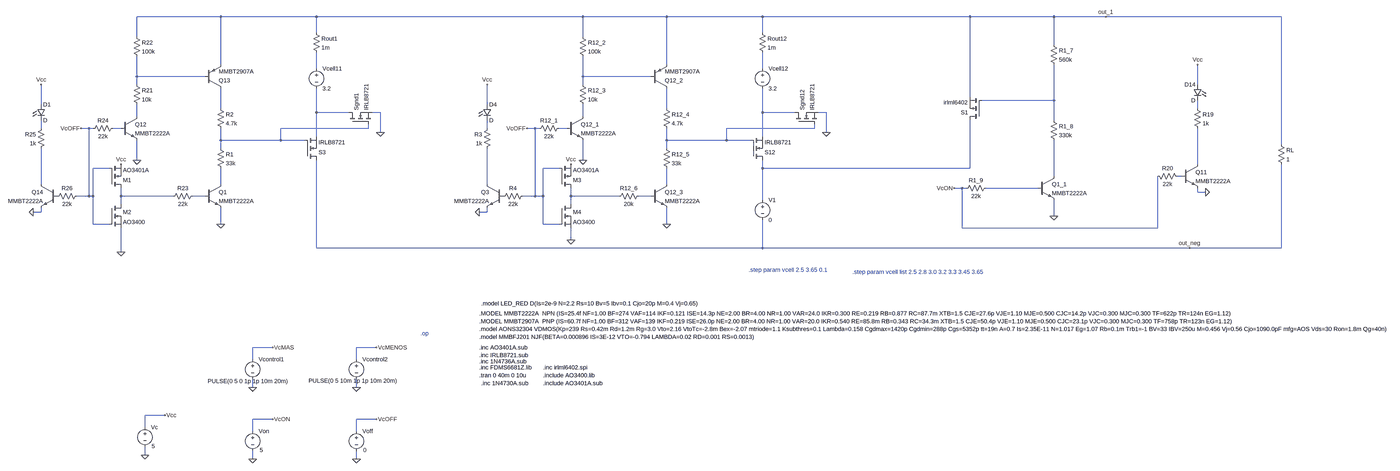
[diagram p0: schematic version_2x1_moset_tierra.asc, whole sheet]
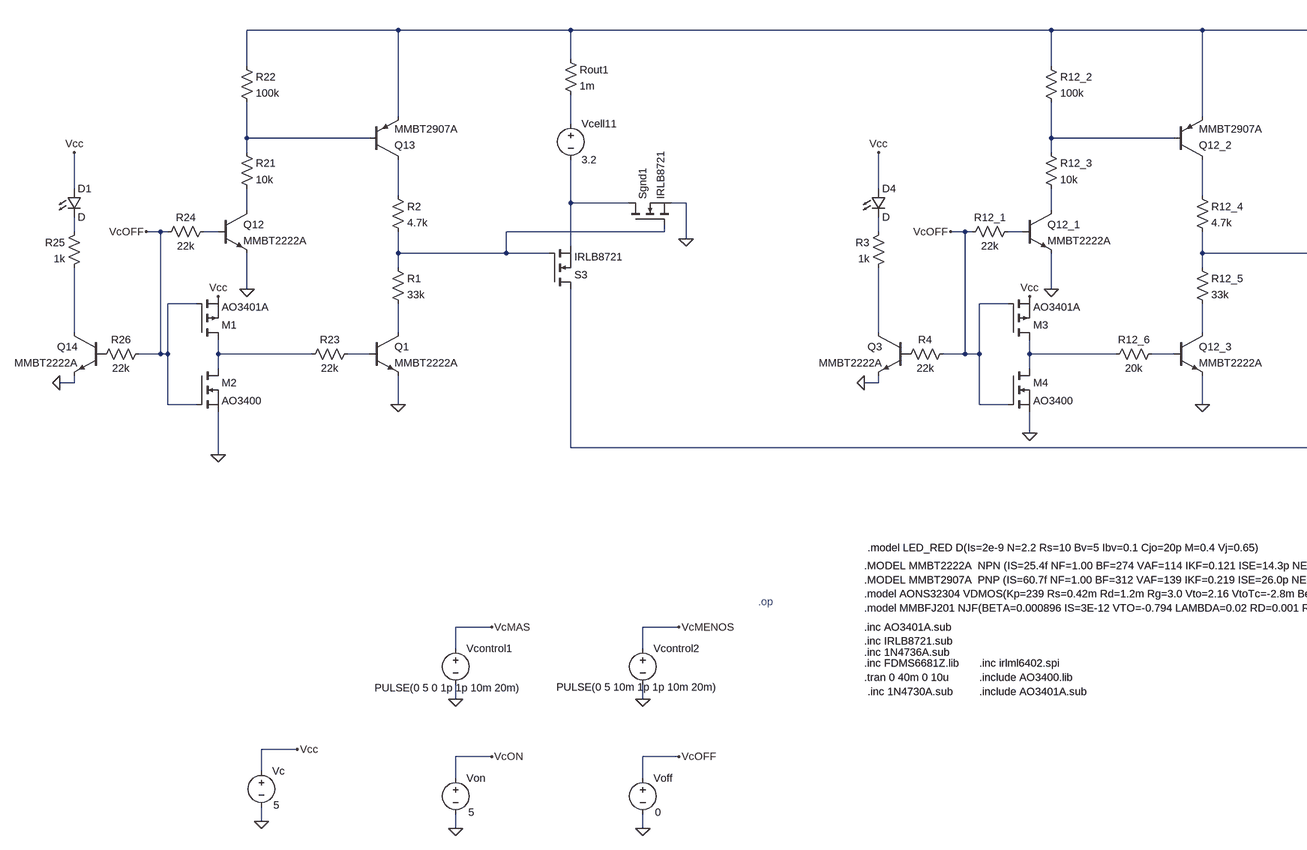
[diagram p1: schematic version_2x1_moset_tierra.asc, part, row 1 of 1, column 1 of 2]
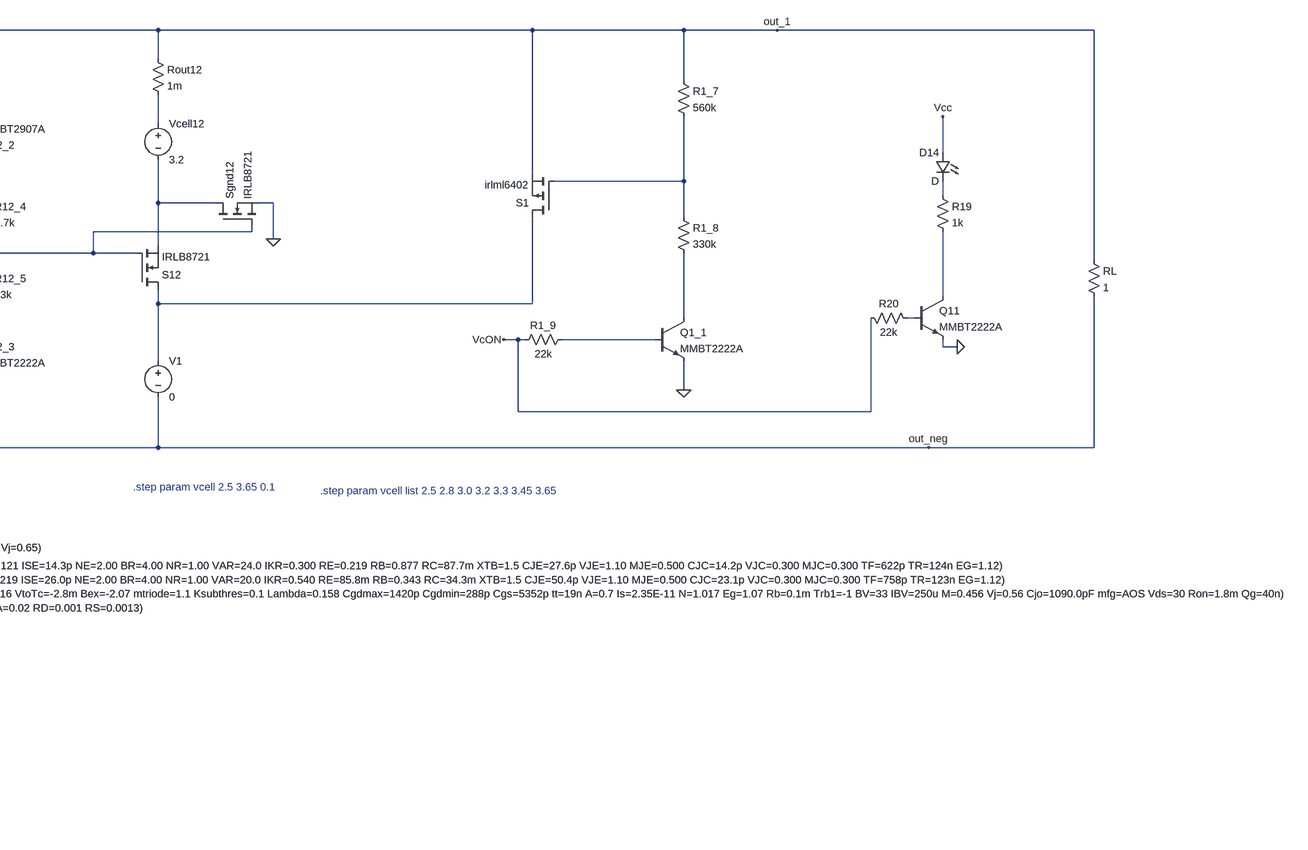
[diagram p2: schematic version_2x1_moset_tierra.asc, part, row 1 of 1, column 2 of 2]
version_2x1_moset_tierra.asc, the LTspice schematic file:
Version 4.1
SHEET 1 7672 2128
WIRE -1280 -368 -1616 -368
WIRE -896 -368 -1280 -368
WIRE 192 -368 -896 -368
WIRE 528 -368 192 -368
WIRE 912 -368 528 -368
WIRE 1744 -368 912 -368
WIRE 2080 -368 1744 -368
WIRE 2288 -368 2080 -368
WIRE 2992 -368 2288 -368
WIRE -896 -304 -896 -368
WIRE 912 -304 912 -368
WIRE -1616 -288 -1616 -368
WIRE 192 -288 192 -368
WIRE 2080 -256 2080 -368
WIRE -1280 -176 -1280 -368
WIRE 528 -176 528 -368
WIRE -896 -160 -896 -224
WIRE 912 -160 912 -224
WIRE -1616 -128 -1616 -208
WIRE -1344 -128 -1616 -128
WIRE 192 -128 192 -208
WIRE 464 -128 192 -128
WIRE -1616 -96 -1616 -128
WIRE 192 -96 192 -128
WIRE 2656 -96 2656 -176
WIRE 1744 -48 1744 -368
WIRE 2080 -32 2080 -176
WIRE 2080 -32 1792 -32
WIRE -2000 -16 -2000 -96
WIRE -192 -16 -192 -96
WIRE -1280 0 -1280 -80
WIRE 528 0 528 -80
WIRE 2656 0 2656 -32
WIRE -896 16 -896 -80
WIRE -768 16 -896 16
WIRE -640 16 -672 16
WIRE 912 16 912 -80
WIRE 1040 16 912 16
WIRE 1168 16 1136 16
WIRE -1616 32 -1616 -16
WIRE 192 32 192 -16
WIRE 2080 48 2080 -32
WIRE -2000 80 -2000 48
WIRE -1808 80 -1840 80
WIRE -1792 80 -1808 80
WIRE -1680 80 -1712 80
WIRE -688 80 -688 64
WIRE -688 80 -1040 80
WIRE -192 80 -192 48
WIRE 0 80 -32 80
WIRE 16 80 0 80
WIRE 128 80 96 80
WIRE 1120 80 1120 64
WIRE 1120 80 768 80
WIRE -640 96 -640 16
WIRE 1168 96 1168 16
WIRE -896 112 -896 16
WIRE 912 112 912 16
WIRE -1280 128 -1280 80
WIRE -1040 128 -1040 80
WIRE -1040 128 -1280 128
WIRE -944 128 -1040 128
WIRE 528 128 528 80
WIRE 768 128 768 80
WIRE 768 128 528 128
WIRE 864 128 768 128
WIRE 2992 144 2992 -368
WIRE -1280 160 -1280 128
WIRE 528 160 528 128
WIRE -1616 208 -1616 128
WIRE 192 208 192 128
WIRE 2656 224 2656 80
WIRE -1728 240 -1792 240
WIRE 96 240 32 240
WIRE 912 240 912 208
WIRE 1744 240 1744 48
WIRE 1744 240 912 240
WIRE 2080 272 2080 128
WIRE 2592 272 2576 272
WIRE -2000 304 -2000 160
WIRE -1280 304 -1280 240
WIRE -192 304 -192 160
WIRE 528 304 528 240
WIRE 1712 320 1680 320
WIRE 1728 320 1712 320
WIRE 2016 320 1808 320
WIRE 2656 336 2656 320
WIRE 2688 336 2656 336
WIRE -1808 352 -1808 80
WIRE -1808 352 -1856 352
WIRE -1792 352 -1792 240
WIRE -1792 352 -1808 352
WIRE -1680 352 -1680 320
WIRE -1472 352 -1680 352
WIRE -1344 352 -1392 352
WIRE 0 352 0 80
WIRE 0 352 -48 352
WIRE 32 352 32 240
WIRE 32 352 0 352
WIRE 144 352 144 320
WIRE 336 352 144 352
WIRE 464 352 416 352
WIRE 912 368 912 240
WIRE -1680 384 -1680 352
WIRE 144 384 144 352
WIRE -2000 416 -2000 400
WIRE -2000 416 -2032 416
WIRE -192 416 -192 400
WIRE -192 416 -224 416
WIRE 2080 432 2080 368
WIRE -1792 464 -1792 352
WIRE -1728 464 -1792 464
WIRE -1280 464 -1280 400
WIRE 32 464 32 352
WIRE 96 464 32 464
WIRE 528 464 528 400
WIRE 1712 480 1712 320
WIRE 2496 480 2496 272
WIRE 2496 480 1712 480
WIRE 144 528 144 480
WIRE -896 560 -896 208
WIRE 912 560 912 448
WIRE 912 560 -896 560
WIRE 2624 560 912 560
WIRE 2992 560 2992 224
WIRE 2992 560 2624 560
WIRE -1680 576 -1680 480
WIRE -1072 1024 -1152 1024
WIRE -656 1024 -736 1024
WIRE -1152 1072 -1152 1024
WIRE -736 1072 -736 1024
WIRE -1152 1184 -1152 1152
WIRE -736 1184 -736 1152
WIRE -1504 1296 -1584 1296
WIRE -1072 1312 -1152 1312
WIRE -656 1312 -736 1312
WIRE -1584 1344 -1584 1296
WIRE -1152 1360 -1152 1312
WIRE -736 1360 -736 1312
WIRE -1584 1456 -1584 1424
WIRE -1152 1472 -1152 1440
WIRE -736 1472 -736 1440
FLAG 192 208 0
FLAG 528 464 0
FLAG -1152 1184 0
FLAG -736 1184 0
FLAG -1072 1024 VcMAS
FLAG -656 1024 VcMENOS
FLAG -736 1472 0
FLAG -656 1312 VcOFF
FLAG -1152 1472 0
FLAG -1072 1312 VcON
FLAG -32 80 VcOFF
FLAG 2624 560 out_neg
FLAG 2288 -368 out_1
FLAG 2080 432 0
FLAG 1680 320 VcON
FLAG 1168 96 0
FLAG -224 416 0
FLAG 2688 336 0
FLAG 2656 -176 Vcc
FLAG -192 -96 Vcc
FLAG -1616 208 0
FLAG -1280 464 0
FLAG -1840 80 VcOFF
FLAG -640 96 0
FLAG -2032 416 0
FLAG -2000 -96 Vcc
FLAG -1680 576 0
FLAG -1680 224 Vcc
FLAG -1584 1456 0
FLAG -1504 1296 Vcc
FLAG 144 528 0
FLAG 144 224 Vcc
SYMBOL npn 464 304 R0
SYMATTR InstName Q12_3
SYMATTR Value MMBT2222A
SYMBOL res 512 144 R0
SYMATTR InstName R12_5
SYMATTR Value 33k
SYMBOL res 512 -16 R0
SYMATTR InstName R12_4
SYMATTR Value 4.7k
SYMBOL npn 128 32 R0
SYMATTR InstName Q12_1
SYMATTR Value MMBT2222A
SYMBOL res 176 -112 R0
SYMATTR InstName R12_3
SYMATTR Value 10k
SYMBOL res 176 -304 R0
SYMATTR InstName R12_2
SYMATTR Value 100k
SYMBOL res 432 336 R90
WINDOW 0 0 56 VBottom 2
WINDOW 3 32 56 VTop 2
SYMATTR InstName R12_6
SYMATTR Value 20k
SYMBOL voltage 912 -176 R0
WINDOW 123 0 0 Left 0
WINDOW 39 0 0 Left 0
SYMATTR InstName Vcell12
SYMATTR Value 3.2
SYMBOL pnp 464 -80 M180
SYMATTR InstName Q12_2
SYMATTR Value MMBT2907A
SYMBOL nmos 864 208 M180
SYMATTR InstName S12
SYMATTR Value IRLB8721
SYMATTR Prefix X
SYMBOL voltage -1152 1056 R0
WINDOW 3 -180 103 Left 2
WINDOW 123 0 0 Left 0
WINDOW 39 0 0 Left 0
SYMATTR Value PULSE(0 5 0 1p 1p 10m 20m)
SYMATTR InstName Vcontrol1
SYMBOL voltage -736 1056 R0
WINDOW 3 -192 102 Left 2
WINDOW 123 0 0 Left 0
WINDOW 39 0 0 Left 0
SYMATTR Value PULSE(0 5 10m 1p 1p 10m 20m)
SYMATTR InstName Vcontrol2
SYMBOL voltage -736 1344 R0
WINDOW 3 27 92 Left 2
WINDOW 123 0 0 Left 0
WINDOW 39 0 0 Left 0
SYMATTR Value 0
SYMATTR InstName Voff
SYMBOL voltage -1152 1344 R0
WINDOW 3 28 92 Left 2
WINDOW 123 0 0 Left 0
WINDOW 39 0 0 Left 0
SYMATTR Value 5
SYMATTR InstName Von
SYMBOL res 112 64 R90
WINDOW 0 0 56 VBottom 2
WINDOW 3 32 56 VTop 2
SYMATTR InstName R12_1
SYMATTR Value 22k
SYMBOL res 896 -320 R0
SYMATTR InstName Rout12
SYMATTR Value 1m
SYMBOL npn 2016 272 R0
SYMATTR InstName Q1_1
SYMATTR Value MMBT2222A
SYMBOL res 1824 304 R90
WINDOW 0 0 56 VBottom 2
WINDOW 3 32 56 VTop 2
SYMATTR InstName R1_9
SYMATTR Value 22k
SYMBOL res 2064 -272 R0
SYMATTR InstName R1_7
SYMATTR Value 560k
SYMBOL nmos 1040 64 R270
SYMATTR InstName Sgnd12
SYMATTR Value IRLB8721
SYMATTR Prefix X
SYMBOL pmos 1792 48 R180
SYMATTR InstName S1
SYMATTR Value irlml6402
SYMATTR Prefix X
SYMBOL voltage 912 352 R0
WINDOW 123 0 0 Left 0
WINDOW 39 0 0 Left 0
SYMATTR InstName V1
SYMATTR Value 0
SYMBOL npn -128 304 M0
SYMATTR InstName Q3
SYMATTR Value MMBT2222A
SYMBOL res -176 64 M0
SYMATTR InstName R3
SYMATTR Value 1k
SYMBOL res -32 336 R90
WINDOW 0 0 56 VBottom 2
WINDOW 3 32 56 VTop 2
SYMATTR InstName R4
SYMATTR Value 22k
SYMBOL LED -208 -16 R0
SYMATTR InstName D4
SYMBOL npn 2592 224 R0
SYMATTR InstName Q11
SYMATTR Value MMBT2222A
SYMBOL res 2640 -16 R0
SYMATTR InstName R19
SYMATTR Value 1k
SYMBOL res 2480 256 M90
WINDOW 0 0 56 VBottom 2
WINDOW 3 32 56 VTop 2
SYMATTR InstName R20
SYMATTR Value 22k
SYMBOL LED 2672 -96 M0
SYMATTR InstName D14
SYMBOL res 2064 32 R0
SYMATTR InstName R1_8
SYMATTR Value 330k
SYMBOL npn -1344 304 R0
SYMATTR InstName Q1
SYMATTR Value MMBT2222A
SYMBOL res -1296 144 R0
SYMATTR InstName R1
SYMATTR Value 33k
SYMBOL res -1296 -16 R0
SYMATTR InstName R2
SYMATTR Value 4.7k
SYMBOL npn -1680 32 R0
SYMATTR InstName Q12
SYMATTR Value MMBT2222A
SYMBOL res -1632 -112 R0
SYMATTR InstName R21
SYMATTR Value 10k
SYMBOL res -1632 -304 R0
SYMATTR InstName R22
SYMATTR Value 100k
SYMBOL res -1376 336 R90
WINDOW 0 0 56 VBottom 2
WINDOW 3 32 56 VTop 2
SYMATTR InstName R23
SYMATTR Value 22k
SYMBOL voltage -896 -176 R0
WINDOW 123 0 0 Left 0
WINDOW 39 0 0 Left 0
SYMATTR InstName Vcell11
SYMATTR Value 3.2
SYMBOL pnp -1344 -80 M180
SYMATTR InstName Q13
SYMATTR Value MMBT2907A
SYMBOL nmos -944 208 M180
SYMATTR InstName S3
SYMATTR Value IRLB8721
SYMATTR Prefix X
SYMBOL res -1696 64 R90
WINDOW 0 0 56 VBottom 2
WINDOW 3 32 56 VTop 2
SYMATTR InstName R24
SYMATTR Value 22k
SYMBOL res -912 -320 R0
SYMATTR InstName Rout1
SYMATTR Value 1m
SYMBOL nmos -768 64 R270
SYMATTR InstName Sgnd1
SYMATTR Value IRLB8721
SYMATTR Prefix X
SYMBOL npn -1936 304 M0
SYMATTR InstName Q14
SYMATTR Value MMBT2222A
SYMBOL res -1984 64 M0
SYMATTR InstName R25
SYMATTR Value 1k
SYMBOL res -1840 336 R90
WINDOW 0 0 56 VBottom 2
WINDOW 3 32 56 VTop 2
SYMATTR InstName R26
SYMATTR Value 22k
SYMBOL LED -2016 -16 R0
SYMATTR InstName D1
SYMBOL res 2976 128 R0
SYMATTR InstName RL
SYMATTR Value 1
SYMBOL pmos -1728 320 M180
SYMATTR InstName M1
SYMATTR Value AO3401A
SYMATTR Prefix X
SYMBOL nmos -1728 384 R0
SYMATTR InstName M2
SYMATTR Value AO3400
SYMATTR Prefix X
SYMBOL voltage -1584 1328 R0
WINDOW 3 27 92 Left 2
WINDOW 123 0 0 Left 0
WINDOW 39 0 0 Left 0
SYMATTR Value 5
SYMATTR InstName Vc
SYMBOL pmos 96 320 M180
SYMATTR InstName M3
SYMATTR Value AO3401A
SYMATTR Prefix X
SYMBOL nmos 96 384 R0
SYMATTR InstName M4
SYMATTR Value AO3400
SYMATTR Prefix X
TEXT -224 1136 Left 2 !.tran 0 40m 0 10u
TEXT -224 888 Left 2 !.MODEL MMBT2222A  NPN (IS=25.4f NF=1.00 BF=274 VAF=114 IKF=0.121 ISE=14.3p NE=2.00 BR=4.00 NR=1.00 VAR=24.0 IKR=0.300 RE=0.219 RB=0.877 RC=87.7m XTB=1.5 CJE=27.6p VJE=1.10 MJE=0.500 CJC=14.2p VJC=0.300 MJC=0.300 TF=622p TR=124n EG=1.12)\n.MODEL MMBT2907A  PNP (IS=60.7f NF=1.00 BF=312 VAF=139 IKF=0.219 ISE=26.0p NE=2.00 BR=4.00 NR=1.00 VAR=20.0 IKR=0.540 RE=85.8m RB=0.343 RC=34.3m XTB=1.5 CJE=50.4p VJE=1.10 MJE=0.500 CJC=23.1p VJC=0.300 MJC=0.300 TF=758p TR=123n EG=1.12)\n.model AONS32304 VDMOS(Kp=239 Rs=0.42m Rd=1.2m Rg=3.0 Vto=2.16 VtoTc=-2.8m Bex=-2.07 mtriode=1.1 Ksubthres=0.1 Lambda=0.158 Cgdmax=1420p Cgdmin=288p Cgs=5352p tt=19n A=0.7 Is=2.35E-11 N=1.017 Eg=1.07 Rb=0.1m Trb1=-1 BV=33 IBV=250u M=0.456 Vj=0.56 Cjo=1090.0pF mfg=AOS Vds=30 Ron=1.8m Qg=40n)\n.model MMBFJ201 NJF(BETA=0.000896 IS=3E-12 VTO=-0.794 LAMBDA=0.02 RD=0.001 RS=0.0013)
TEXT -224 1024 Left 2 !.inc AO3401A.sub\n.inc IRLB8721.sub
TEXT -224 1080 Left 2 !.inc 1N4736A.sub
TEXT -224 1104 Left 2 !.inc FDMS6681Z.lib
TEXT -216 1168 Left 2 !.inc 1N4730A.sub
TEXT -216 848 Left 2 !.model LED_RED D(Is=2e-9 N=2.2 Rs=10 Bv=5 Ibv=0.1 Cjo=20p M=0.4 Vj=0.65)
TEXT 32 1104 Left 2 !.inc irlml6402.spi
TEXT 32 1136 Left 2 !.include AO3400.lib
TEXT 32 1168 Left 2 !.include AO3401A.sub
TEXT -480 968 Left 2 ;.op
TEXT 856 648 Left 2 ;.step param vcell 2.5 3.65 0.1
TEXT 1272 656 Left 2 ;.step param vcell list 2.5 2.8 3.0 3.2 3.3 3.45 3.65

The netlist it stands for:
* version_2x1_moset_tierra.asc
Q12_3 N026 N031 0 0 MMBT2222A
R12_5 N018 N026 33k
R12_4 N007 N018 4.7k
Q12_1 N012 N017 0 0 MMBT2222A
R12_3 N004 N012 10k
R12_2 out_1 N004 100k
R12_6 N031 N030 20k
Vcell12 N002 N010 3.2
Q12_2 N007 N004 out_1 0 MMBT2907A
X§S12 N020 N018 N010 IRLB8721  ; pins D G S
Vcontrol1 VcMAS 0 PULSE(0 5 0 1p 1p 10m 20m)
Vcontrol2 VcMENOS 0 PULSE(0 5 10m 1p 1p 10m 20m)
Voff VcOFF 0 0
Von VcON 0 5
R12_1 N017 VcOFF 22k
Rout12 out_1 N002 1m
Q1_1 N021 N027 0 0 MMBT2222A
R1_9 N027 VcON 22k
R1_7 out_1 N005 560k
X§Sgnd12 N010 N018 0 IRLB8721  ; pins D G S
X§S1 N020 N005 out_1 irlml6402  ; pins D G S
V1 N020 out_neg 0
Q3 N025 P001 0 0 MMBT2222A
R3 N016 N025 1k
R4 VcOFF P001 22k
D4 Vcc N016 D
Q11 N019 N022 0 0 MMBT2222A
R19 N008 N019 1k
R20 VcON N022 22k
D14 Vcc N008 D
R1_8 N005 N021 330k
Q1 N024 N029 0 0 MMBT2222A
R1 N015 N024 33k
R2 N006 N015 4.7k
Q12 N011 N014 0 0 MMBT2222A
R21 N003 N011 10k
R22 out_1 N003 100k
R23 N029 N028 22k
Vcell11 N001 N009 3.2
Q13 N006 N003 out_1 0 MMBT2907A
X§S3 out_neg N015 N009 IRLB8721  ; pins D G S
R24 N014 VcOFF 22k
Rout1 out_1 N001 1m
X§Sgnd1 N009 N015 0 IRLB8721  ; pins D G S
Q14 N023 P002 0 0 MMBT2222A
R25 N013 N023 1k
R26 VcOFF P002 22k
D1 Vcc N013 D
RL out_1 out_neg 1
X§M1 N028 VcOFF Vcc AO3401A  ; pins D G S
X§M2 N028 VcOFF 0 AO3400  ; pins D G S
Vc Vcc 0 5
X§M3 N030 VcOFF Vcc AO3401A  ; pins D G S
X§M4 N030 VcOFF 0 AO3400  ; pins D G S
.model D D
.lib standard.dio
.model NPN NPN
.model PNP PNP
.lib standard.bjt
.tran 0 40m 0 10u
.MODEL MMBT2222A  NPN (IS=25.4f NF=1.00 BF=274 VAF=114 IKF=0.121 ISE=14.3p NE=2.00 BR=4.00 NR=1.00 VAR=24.0 IKR=0.300 RE=0.219 RB=0.877 RC=87.7m XTB=1.5 CJE=27.6p VJE=1.10 MJE=0.500 CJC=14.2p VJC=0.300 MJC=0.300 TF=622p TR=124n EG=1.12)
.MODEL MMBT2907A  PNP (IS=60.7f NF=1.00 BF=312 VAF=139 IKF=0.219 ISE=26.0p NE=2.00 BR=4.00 NR=1.00 VAR=20.0 IKR=0.540 RE=85.8m RB=0.343 RC=34.3m XTB=1.5 CJE=50.4p VJE=1.10 MJE=0.500 CJC=23.1p VJC=0.300 MJC=0.300 TF=758p TR=123n EG=1.12)
.model AONS32304 VDMOS(Kp=239 Rs=0.42m Rd=1.2m Rg=3.0 Vto=2.16 VtoTc=-2.8m Bex=-2.07 mtriode=1.1 Ksubthres=0.1 Lambda=0.158 Cgdmax=1420p Cgdmin=288p Cgs=5352p tt=19n A=0.7 Is=2.35E-11 N=1.017 Eg=1.07 Rb=0.1m Trb1=-1 BV=33 IBV=250u M=0.456 Vj=0.56 Cjo=1090.0pF mfg=AOS Vds=30 Ron=1.8m Qg=40n)
.model MMBFJ201 NJF(BETA=0.000896 IS=3E-12 VTO=-0.794 LAMBDA=0.02 RD=0.001 RS=0.0013)
.inc AO3401A.sub
.inc IRLB8721.sub
.inc 1N4736A.sub
.inc FDMS6681Z.lib
.inc 1N4730A.sub
.model LED_RED D(Is=2e-9 N=2.2 Rs=10 Bv=5 Ibv=0.1 Cjo=20p M=0.4 Vj=0.65)
.inc irlml6402.spi
.include AO3400.lib
.include AO3401A.sub
* .op
* .step param vcell 2.5 3.65 0.1
* .step param vcell list 2.5 2.8 3.0 3.2 3.3 3.45 3.65
.backanno
.end